# Altium schematic sheet hat.SchDoc: Micro controller test
size A3; DrawnBy: Mark Arunchayanon, Luke Trenberth, Abhimanyu Chhabara, Sasiru Goonatillake; Address1: ECE Department; Address2: University of Canterbury; Address3: Christchurch 8041; Address4: New Zealand; Revision: 1
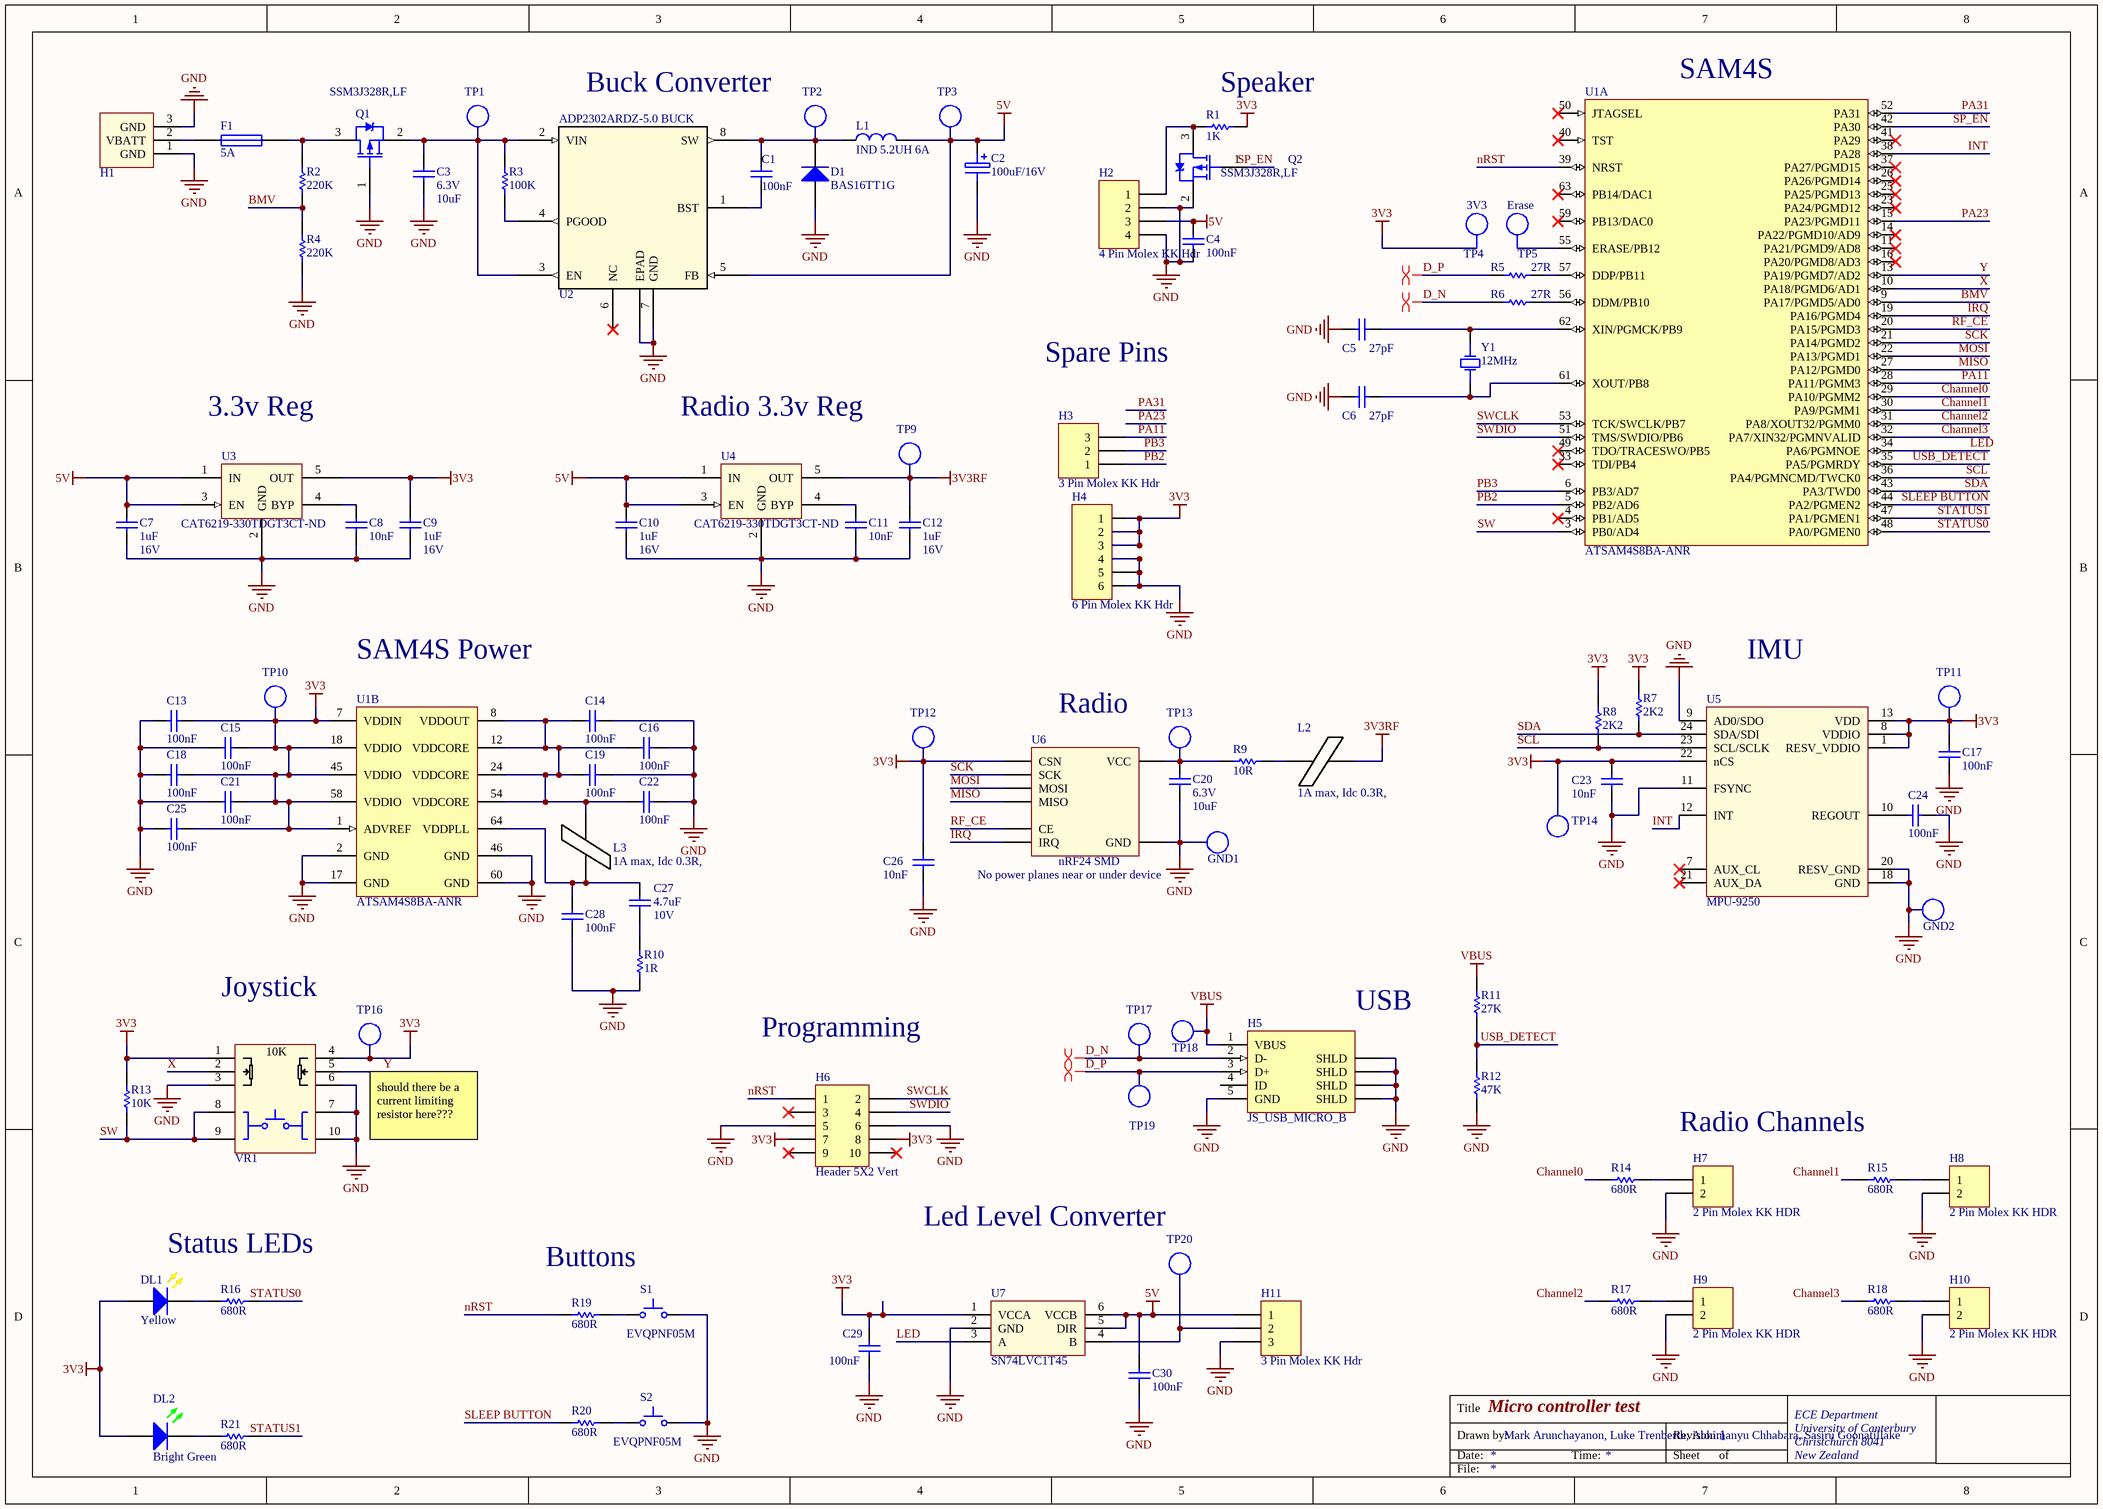
[diagram p0: hat.SchDoc]

## Parts
C1  100nF  [CAPC1608L]
C2  100uF/16V  [NICH-1]
C3  Voltage - Rated: 6.3V  [CAPC1608L]  (hidden comment: 10uF)
C4  100nF  [CAPC1608L]
C5  27pF  [CAPC1608L]
C6  27pF  [CAPC1608L]
C7  Max Voltage: 16V  [CAPC1608L]  (hidden comment: 1uF)
C8  10nF  [CAPC1608L]
C9  Max Voltage: 16V  [CAPC1608L]  (hidden comment: 1uF)
C10  Max Voltage: 16V  [CAPC1608L]  (hidden comment: 1uF)
C11  10nF  [CAPC1608L]
C12  Max Voltage: 16V  [CAPC1608L]  (hidden comment: 1uF)
C13  100nF  [CAPC1608L]
C14  100nF  [CAPC1608L]
C15  100nF  [CAPC1608L]
C16  100nF  [CAPC1608L]
C17  100nF  [CAPC1608L]
C18  100nF  [CAPC1608L]
C19  100nF  [CAPC1608L]
C20  Voltage - Rated: 6.3V  [CAPC1608L]  (hidden comment: 10uF)
C21  100nF  [CAPC1608L]
C22  100nF  [CAPC1608L]
C23  10nF  [CAPC1608L]
C24  100nF  [CAPC1608L]
C25  100nF  [CAPC1608L]
C26  10nF  [CAPC1608L]
C27  Max Voltage: 10V  [CAPC1608N]  (hidden comment: 4.7uF)
C28  100nF  [CAPC1608L]
C29  100nF  [CAPC1608L]
C30  100nF  [CAPC1608L]
D1  BAS16TT1G  [SOT416]
DL1  Yellow  [WL-SMCW0603]
DL2  Bright Green  [WL-SMCW0603]
F1  5A  [RESC3216N]
GND1  TP_0603  [TP_0603]  (value not drawn)
GND2  TP_0603  [TP_0603]  (value not drawn)
H1  Battery_HEADER_3pin  [BATT_HEADER_3POS]  (value not drawn)
H2  value 4 Pin Molex KK Hdr  [MOLEX_KK_4_HDR]  (hidden comment: SMD Vert 1.25mm)
H3  3 Pin Molex KK Hdr  [MOLEX_KK_3_HDR]
H4  value 6 Pin Molex KK Hdr  [MOLEX_KK_6_HDR]  (hidden comment: SMD Vert 1.25mm)
H5  JS_USB_MICRO_B  [FCI_USB_10118194-0001LF]
H6  Header 5X2 Vert  [IDC2.54-V10D]
H7  value 2 Pin Molex KK HDR  [MOLEX_KK_2_HDR]  (hidden comment: SMD Vert 1.25mm)
H8  value 2 Pin Molex KK HDR  [MOLEX_KK_2_HDR]  (hidden comment: SMD Vert 1.25mm)
H9  value 2 Pin Molex KK HDR  [MOLEX_KK_2_HDR]  (hidden comment: SMD Vert 1.25mm)
H10  value 2 Pin Molex KK HDR  [MOLEX_KK_2_HDR]  (hidden comment: SMD Vert 1.25mm)
H11  value 3 Pin Molex KK Hdr  [MOLEX_KK_3_HDR]  (hidden comment: SMD Vert 1.25mm)
L1  IND 5.2UH 6A  [INDUCTOR5u2]
L2  1A max, Idc 0.3R,  [INDC3216L]
L3  1A max, Idc 0.3R,  [INDC3216L]
Q1  SSM3J328R,LF  [SOT23_L]
Q2  SSM3J328R,LF  [SOT23_L]
R1  1K  [RESC1608L]
R2  220K  [RESC1608L]
R3  100K  [RESC1608L]
R4  220K  [RESC1608L]
R5  27R  [RESC3216L]
R6  27R  [RESC3216L]
R7  2K2  [RESC1608L]
R8  2K2  [RESC1608L]
R9  10R  [RESC1608L]
R10  1R  [RESC3216L]
R11  27K  [RESC1608L]
R12  47K  [RESC1608N]
R13  10K  [RESC1608L]
R14  680R  [RESC1608L]
R15  680R  [RESC1608L]
R16  680R  [RESC1608L]
R17  680R  [RESC1608L]
R18  680R  [RESC1608L]
R19  680R  [RESC1608L]
R20  680R  [RESC1608L]
R21  680R  [RESC1608L]
S1  EVQPNF05M  [EVQPNF05M]
S2  EVQPNF05M  [EVQPNF05M]
TP1  TP_0603  [TP_0603]  (value not drawn)
TP2  TP_0603  [TP_0603]  (value not drawn)
TP3  TP_0603  [TP_0603]  (value not drawn)
TP4  3V3  [TP_1206]  (no BOM)
TP5  Erase  [TP_1206]  (no BOM)
TP9  TP_0603  [TP_0603]  (value not drawn)
TP10  TP_0603  [TP_0603]  (value not drawn)
TP11  TP_0603  [TP_0603]  (value not drawn)
TP12  TP_0603  [TP_0603]  (value not drawn)
TP13  TP_0603  [TP_0603]  (value not drawn)
TP14  TP_0603  [TP_0603]  (value not drawn)
TP16  TP_0603  [TP_0603]  (value not drawn)
TP17  TP_0603  [TP_0603]  (value not drawn)
TP18  TP_0603  [TP_0603]  (value not drawn)
TP19  TP_0603  [TP_0603]  (value not drawn)
TP20  TP_0603  [TP_0603]  (value not drawn)
U1  ATSAM4S8BA-ANR  [LQFP64_L]  (parts A,B of 2)
U2  ADP2302ARDZ-5.0 BUCK  [RD_8_1]
U3  Supplier Part Number: CAT6219-330TDGT3CT-ND  [SOT95P280X145-5N]  (hidden comment: CAT6219-330TDGT3)
U4  Supplier Part Number: CAT6219-330TDGT3CT-ND  [SOT95P280X145-5N]  (hidden comment: CAT6219-330TDGT3)
U5  MPU-9250  [Quad24]
U6  nRF24 SMD  Warning: No power planes near or under device  [NRF24]
U7  SN74LVC1T45  [SOT23-6_N]
VR1  Joystick 10k with Sw  [Joystick_Sw]  (value not drawn)
Y1  12MHz  [6.0X3.5-4]

## Nets
3V3: C9.2 C13.1 C15.1 C17.2 C18.1 C21.1 C23.2 C25.1 C26.2 C29.1 DL1.2(A) DL2.2(A) H4.1 H4.2 H4.3 H6.7 H6.8 R1.2 R7.2 R8.2 R13.2 TP4.1 TP10.1(TP) TP11.1(TP) TP12.1(TP) TP14.1(TP) TP16.1(TP) U1.1(ADVREF) U1.7(VDDIN) U1.18(VDDIO) U1.45(VDDIO) U1.58(VDDIO) U3.5(OUT) U5.1(RESV_VDDIO) U5.8(VDDIO) U5.13(VDD) U5.22(nCS) U6.4(CSN) U7.1(VCCA) VR1.1 VR1.4(1')
3V3RF: C12.2 L2.2 TP9.1(TP) U4.5(OUT)
5V: C2.2 C4.2 C7.2 C10.2 C30.1 H2.3 H11.1 L1.2 TP3.1(TP) U2.5(FB) U3.1(IN) U3.3(EN) U4.1(IN) U4.3(EN) U7.5(DIR) U7.6(VCCB)
GND: C2.1 C3.1 C4.1 C5.1 C6.1 C7.1 C8.1 C9.1 C10.1 C11.1 C12.1 C13.2 C14.1 C15.2 C16.1 C17.1 C18.2 C19.1 C20.1 C21.2 C22.1 C23.1 C24.1 C25.2 C26.1 C28.2 C29.2 C30.2 D1.1(A) GND1.1(TP) GND2.1(TP) H1.1(GND) H1.3(GND) H2.2 H2.4 H4.4 H4.5 H4.6 H5.5(GND) H5.6(SHLD) H6.5 H6.6 H7.2 H8.2 H9.2 H10.2 H11.3 Q1.1 Q2.2 R4.1 R10.1 R12.1 S1.2 S2.2 U1.2(GND) U1.17(GND) U1.46(GND) U1.60(GND) U2.7(GND) U2.EPAD U3.2(GND) U4.2(GND) U5.9(AD0/SDO) U5.11(FSYNC) U5.18(GND) U5.20(RESV_GND) U6.2(GND) U7.2(GND) VR1.3 VR1.6(3') VR1.7 VR1.10
VBUS: H5.1(VBUS) R11.2 TP18.1(TP)
BMV: R2.1 R4.2 U1.9(PA17/PGMD5/AD0)
Channel0: R14.1 U1.29(PA10/PGMM2)
Channel1: R15.1 U1.30(PA9/PGMM1)
Channel2: R17.1 U1.31(PA8/XOUT32/PGMM0)
Channel3: R18.1 U1.32(PA7/XIN32/PGMNVALID)
D_N: H5.2(D-) R6.1 TP17.1(TP)
D_P: H5.3(D+) R5.1 TP19.1(TP)
INT: U1.38(PA28) U5.12(INT)
IRQ: U1.19(PA16/PGMD4) U6.8(IRQ)
LED: U1.34(PA6/PGMNOE) U7.3(A)
MISO: U1.27(PA12/PGMD0) U6.7(MISO)
MOSI: U1.22(PA13/PGMD1) U6.6(MOSI)
nRST: H6.1 R19.1 U1.39(NRST)
PA11: H3.3 U1.28(PA11/PGMM3)
PA23: U1.15(PA23/PGMD11)
PA31: U1.52(PA31)
PB2: H3.1 U1.5(PB2/AD6)
PB3: H3.2 U1.6(PB3/AD7)
RF_CE: U1.20(PA15/PGMD3) U6.3(CE)
SCK: U1.21(PA14/PGMD2) U6.5(SCK)
SCL: R8.1 U1.36(PA4/PGMNCMD/TWCK0) U5.23(SCL/SCLK)
SDA: R7.1 U1.43(PA3/TWD0) U5.24(SDA/SDI)
SLEEP BUTTON: R20.1 U1.44(PA2/PGMEN2)
SP_EN: Q2.1 U1.42(PA30)
STATUS0: R16.2 U1.48(PA0/PGMEN0)
STATUS1: R21.2 U1.47(PA1/PGMEN1)
SW: R13.1 U1.3(PB0/AD4) VR1.8 VR1.9
SWCLK: H6.2 U1.53(TCK/SWCLK/PB7)
SWDIO: H6.4 U1.51(TMS/SWDIO/PB6)
USB_DETECT: R11.1 R12.2 U1.35(PA5/PGMRDY)
X: U1.10(PA18/PGMD6/AD1) VR1.2
Y: U1.13(PA19/PGMD7/AD2) VR1.5(2')
NetC1_1: C1.1 D1.3(K) L1.1 TP2.1(TP) U2.8(SW)
NetC1_2: C1.2 U2.1(BST)
NetC3_2: C3.2 Q1.2 R3.2 TP1.1(TP) U2.2(VIN) U2.3(EN)
NetC5_2: C5.2 U1.62(XIN/PGMCK/PB9) Y1.3(OSC2)
NetC6_2: C6.2 U1.61(XOUT/PB8) Y1.1(OSC1)
NetC8_2: C8.2 U3.4(BYP)
NetC11_2: C11.2 U4.4(BYP)
NetC14_2: C14.2 C16.2 C19.2 C22.2 L3.2 U1.8(VDDOUT) U1.12(VDDCORE) U1.24(VDDCORE) U1.54(VDDCORE)
NetC20_2: C20.2 R9.1 TP13.1(TP) U6.1(VCC)
NetC24_2: C24.2 U5.10(REGOUT)
NetC27_1: C27.1 R10.2
NetC27_2: C27.2 C28.1 L3.1 U1.64(VDDPLL)
NetDL1_1: DL1.1(K) R16.1
NetDL2_1: DL2.1(K) R21.1
NetF1_1: F1.1 H1.2(VBATT)
NetF1_2: F1.2 Q1.3 R2.2
NetH2_1: H2.1 Q2.3 R1.1
NetH7_1: H7.1 R14.2
NetH8_1: H8.1 R15.2
NetH9_1: H9.1 R17.2
NetH10_1: H10.1 R18.2
NetH11_2: H11.2 TP20.1(TP) U7.4(B)
NetL2_1: L2.1 R9.2
NetR3_1: R3.1 U2.4(PGOOD)
NetR5_2: R5.2 U1.57(DDP/PB11)
NetR6_2: R6.2 U1.56(DDM/PB10)
NetR19_2: R19.2 S1.1
NetR20_2: R20.2 S2.1
NetTP5_1: TP5.1 U1.55(ERASE/PB12)

Not connected (* = marked no-connect by the designer): H5 4(ID); H6 3* 9* 10*; U1 4(PB1/AD5)* 11(PA21/PGMD9/AD8)* 14(PA22/PGMD10/AD9)* 16(PA20/PGMD8/AD3)* 23(PA24/PGMD12)* 25(PA25/PGMD13)* 26(PA26/PGMD14)* 33(TDI/PB4)* 37(PA27/PGMD15)* 40(TST)* 41(PA29)* 49(TDO/TRACESWO/PB5)* 50(JTAGSEL)* 59(PB13/DAC0)* 63(PB14/DAC1)*; U2 6(NC)*; U5 7(AUX_CL)* 21(AUX_DA)*

## Layout directives
differential pair: D_N, D_P

## Notes on the sheet
- Buck Converter
- (near R1) Speaker
- (near U1) SAM4S
- Spare Pins
- 3.3v Reg
- Radio 3.3v Reg
- SAM4S Power
- Radio
- IMU
- Joystick
- Programming
- (near H5) USB
- (near TP16) should there be a current limiting resistor here???
- Radio Channels
- Status LEDs
- (near TP20) Led Level Converter
- Buttons
- Title
- Drawn by:
- Date:
- Time:
- Revision:
- Sheet
- of
- File:
- (in symbol Joystick 10k with Sw) 10K

## Library data of the parts
C1 C4 C13-C19 C21 C22 C24 C25 C28-C30 = CC_100nF_0603: CAP CER 100nF X7R +-10% 50V 0603; PackageReference: 0603; Code_IPC: 1608 [0603]; Verify: *; Supplier: ECE Dept; Storage Location: PCB Assembly WS; Value: 100nF
C2 = CA_100uF_16V: CAP ALUM 100uF 16V SMD; Manufacturer PN: UWX1C101MCL1GB; Manufacturer: Nichcon; Supplier 1: Farnell; Supplier Part Number 1: 1870677; Storage Location: PCB Assembly WS; Supplier: ECE Dept; Supplier 2: Digi-Key; Supplier Part Number 2: 493-2105-1-ND; Value: 100uF/16V
C3 C20 = CC_10uF_0603: CAP CER 10UF X5R +-20% 6V3 0603; Supplier: ECE Dept; Storage Location: PCB Assembly WS; Value: 10uF
C5 C6 = CC_27pF_0603: CAP CER 27pF NPO/COG +-5% 50V 0603; PackageReference: 0603; Code_IPC: 1608 [0603]; Verify: *; Supplier: ECE Dept; Storage Location: PCB Assembly WS; Value: 27pF
C7 C9 C10 C12 = CC_1uF_0603: CAP CER 1uF Y5V -20% +80% 16V 0603; PackageReference: 0603; Code_IPC: 1608 [0603]; Verify: *; Supplier: ECE Dept; Storage Location: PCB Assembly WS; Value: 1uF
C8 C11 C23 C26 = CC_10nF_0603: CAP CER 10nF X7R +-10% 50V 0603; PackageReference: 0603; Code_IPC: 1608 [0603]; Verify: *; Supplier: ECE Dept; Storage Location: PCB Assembly WS; Value: 10nF
C27 = CC_4.7uF_0603: CAP CER 4.7uF X5R +-20%  10V 0603; Note: Footprint corresponds to dimensions for bulk cassette packaging. This case size has tightened tolerances.; PackageReference: 0805; Code_IPC: 2012[0805]; Verify: *; Supplier: ECE Dept; Storage Location: PCB Assembly WS; Value: 4.7uF
D1 = DR_BAS16TT1G: Diode Switching, Vr 75V, 200mA, SOT-416; Manufacturer: ON Semiconductor; Max Surge Current: 500mA; Forward Voltage: 1.25V; Peak Reverse Current: 1uA; Recovery Time: 6ns; Power Dissipation: 225mW; Element Configuration: Single; Polarity: Standard; Max Reverse Voltage (DC): 100V; Manufacturer PN: BAS16TT1G; Storage Location: PCB Assembly WS; Supplier: ECE Dept; Manufacturer Part Number: BAS16TT1G; Case/Package: SOT-416-3; Number of Pins: 3; Contact Plating: Tin,Matte; Min Operating Temperature: -55°C; Max Operating Temperature: 150°C; Package Quantity: 1; Packaging: Tape and Reel; Forward Current: 200mA; Average Rectified Current: 200mA; Reverse Recovery Time: 6ns; Peak Non-Repetitive Surge Current: 500mA; Max Repetitive Reverse Voltage (Vrrm): 75V; Max Forward Surge Current (Ifsm): 500mA; Current Rating: 200mA; Output Current: 200mA; Length: 1.65mm; Height: 0.9mm; Width: 0.9mm; Radiation Hardening: No; REACH SVHC: No SVHC; Lead Free: Lead Free; Halogen Free: Halogen Free; ComponentLink1URL: https://datasheet.ciiva.com/8299/bas16tt1-d-8299729.pdf; ComponentLink1Description: https://datasheet.ciiva.com/8299/bas16tt1-d-8299729.pdf; ComponentLink2URL: https://datasheet.ciiva.com/4435/bas16tt1-d-103455-4435027.pdf; ComponentLink2Description: https://datasheet.ciiva.com/4435/bas16tt1-d-103455-4435027.pdf; ComponentLink3URL: https://datasheet.ciiva.com/28646/bas16tt1-d-28646580.pdf; ComponentLink3Description: https://datasheet.ciiva.com/28646/bas16tt1-d-28646580.pdf; ComponentLink4URL: https://datasheet.ciiva.com/16393/bas16tt1-d-16393622.pdf; ComponentLink4Description: https://datasheet.ciiva.com/16393/bas16tt1-d-16393622.pdf; ComponentLink5URL: https://datasheet.ciiva.com/923/bas16tt1-d-923016.pdf; ComponentLink5Description: https://datasheet.ciiva.com/923/bas16tt1-d-923016.pdf; ComponentLink6URL: https://datasheet.ciiva.com/923/bas16tt1-d-923017.pdf; ComponentLink6Description: https://datasheet.ciiva.com/923/bas16tt1-d-923017.pdf; ComponentLink7URL: https://datasheet.ciiva.com/923/bas16tt1-d-923018.pdf; ComponentLink7Description: https://datasheet.ciiva.com/923/bas16tt1-d-923018.pdf; ComponentLink8URL: https://datasheet.ciiva.com/25930/bas16tt1-d-25930986.pdf; ComponentLink8Description: https://datasheet.ciiva.com/25930/bas16tt1-d-25930986.pdf; Supplier 1: Digi-Key; Supplier 2: Farnell; Supplier Part Number 2: 2844752; Supplier Part Number 1: BAS16TT1GOSDKR-ND; Value: BAS16TT1G
DL1 = DL_150060YS75000: LED Yellow 120mcd 0603 SMD; Manufacturer: WURTH ELEKTRONIK; Forward Current If: 30; Forward Voltage: 2; Wavelength Typ: 590; Lens Shape: Rectangular; Viewing Angle: 140°; Luminous Intensity: 120; LED Mounting: SMD; Supplier 1: Farnell; Supplier Part Number 1: 2322074; Manufacturer Part Number: 150060YS75000; Storage Location: PCB Assembly WS; Supplier: ECE Dept; LED Colour: Yellow
DL2 = DL_150060VS75000: LED Bright Green 40mcd 0603 SMD; Manufacturer: WURTH ELEKTRONIK; Forward Current If: 30; Forward Voltage: 2; Viewing Angle: 140°; Wavelength Typ: 570; Luminous Intensity: 40; LED Mounting: SMD; Supplier 1: Farnell; Supplier Part Number 1: 2322073; Manufacturer Part Number: 150060VS75000; Storage Location: PCB Assembly WS; Supplier: ECE Dept; LED Colour: Bright Green
F1 = FS_Fuse_5.0A: Fuse 5.0A Fast Acting 1206 SMD; Manufacturer Part Number: C1F5; Manufacturer: Bel TRP; Voltage Rating (AC): 125V; Voltage Rating (DC): 63V; DC Cold Resistance: 19mR; Fuse Type: Board Mount (Cartridge Style Excluded); Approvals: CE,cURus; Mount: Surface Mount; Case/Package: 1206; Number of Pins: 2; Case Code (Metric): 3216; Case Code (Imperial): 1206; Contact Plating: Nickel,Tin; Min Operating Temperature: -55°C; Max Operating Temperature: 125°C; Packaging: Tape and Reel; Voltage Rating: 125V; Length: 0.126inch; Width: 0.062inch; Supplier 1: Digi-Key; Stock 1: 725; Pricing 1: 1=0.32, 5=0.312, 10=0.298, 50=0.2662, 100=0.2479, 250=0.22032, 500=0.1836, 1000=0.17442 (USD); ComponentLink1URL: http://www.farnell.com/datasheets/2571625.pdf; ComponentLink1Description: http://www.farnell.com/datasheets/2571625.pdf; ComponentLink2URL: http://belfuse.com/pdfs/C1F.pdf; ComponentLink2Description: http://belfuse.com/pdfs/C1F.pdf; ComponentLink3URL: http://www.mouser.com/ds/2/643/C1F-594910.pdf; ComponentLink3Description: http://www.mouser.com/ds/2/643/C1F-594910.pdf; ComponentLink4URL: https://belfuse.com/resources/StewartConnector/C1F.pdf; ComponentLink4Description: https://belfuse.com/resources/StewartConnector/C1F.pdf; Current Rating: 5A; Supplier Part Number 1: 507-1886-1-ND; Supplier 2: Element14; Supplier Part Number 2: 2848595; Value: 5A
GND1 GND2 TP1-TP3 TP9-TP14 TP16-TP20 = TP_0603: Test Point 1.65X0.9X1.2mm SMD; Manufacturer: TE Connectivity AMP Connectors; Manufacturer Part Number: 1625854-3; Supplier 1: Digi-Key; Mounting Type: Surface Mount; Terminal: 0.063" x 0.031" x 0.045" (1.60mm x 0.80mm x 1.15mm); Type: PC Test Point; Supplier Part Number 1: A106145CT-ND
H1 = Battery_HEADER_3pin: 3Pin Header 2.54mm spacing
H2 = JA_MOLEX_KK_4POS: CONN HEADER 4POS 2.54mm VERT_Thru Hole; Manufacturer: Molex; Manufacturer PN: 22-23-2041; Supplier 1: Farnell; Supplier Part Number 1: 9731164; Supplier: ECE Dept; Storage Location: ECE Dept Store
H3 = JA_MOLEX_KK_3POS: CONN HEADER 3POS 2.54mm VERT_Thru Hole; Manufacturer: Molex; Manufacturer PN: 22-23-2031; Supplier 1: Farnell; Supplier Part Number 1: 9731156; Supplier: ECE Dept; Storage Location: ECE Dept Store; Value: 3 Pin Molex KK Hdr
H4 = JA_MOLEX_KK_6POS: CONN HEADER 6POS 2.54mm VERT_Thru Hole; Supplier 1: Farnell; Supplier Part Number 1: 1462922; Supplier: ECE Dept; Storage Location: ECE Dept Store
H5 = JS_USB_MICRO_B_SMT: CONN USB MICRO B RECPT SMT R/A; Manufacturer: FCI; Manufacturer Part Number: 10118194-0001LF; Gender: Receptacle; Number of Contacts: 5; Specifications: USB 2.0; Supplier 1: Digi-Key; Supplier Part Number 1: 609-4618-1-ND; Features: Shielded, Solder Retention; Mounting Type: Surface Mount, Right Angle, Horizontal
H6 = JA_HDR_IDC_5X2_VERT: IDC Header, 2,54mm, 10-Pin, Vert; Supplier: ECE Dept; Supplier 1: Farnell; Supplier Part Number 1: 1096985; Storage Location: ECE Dept Store
H7-H10 = JA_MOLEX_KK_2POS: CONN HEADER 2POS 2.54mm VERT_Thru Hole; Supplier 1: Farnell; Supplier Part Number 1: 1462926; Supplier: ECE Dept; Storage Location: ECE Dept Store
H11 = JA_MOLEX_KK_3POS: CONN HEADER 3POS 2.54mm VERT_Thru Hole; Manufacturer: Molex; Supplier 1: Farnell; Supplier Part Number 1: 9731156; Supplier: ECE Dept; Storage Location: ECE Dept Store; Manufacturer PN: 22-23-2031
L1 = CDRH104RNP-5R2NC: FIXED IND 5.2UH 6A 22 MOHM SMD; Manufacturer: Sumida America Components Inc.; Material - Core: Ferrite; Tolerance: ±30%; Current - Saturation: 5.6A; Shielding: Shielded; DC Resistance (DCR): 22 mOhm Max; Supplier 1: Digi-Key; Manufacturer Part Number: CDRH104RNP-5R2NC; RoHS: RoHS Compliant; Category: Inductors, Coils, Chokes; Stock 1: 3849; Pricing 1: 1=2.9, 10=2.678, 100=1.8743, 500=1.5173 (NZD); Packaging: Cut Tape (CT); Part Status: Active; Type: -; Q @ Freq: -; Frequency - Self Resonant: -; Ratings: -; Operating Temperature: -40°C ~ 100°C; Mounting Type: Surface Mount; Package / Case: Nonstandard; Supplier Device Package: -; Size / Dimension: 0.402" L x 0.394" W (10.20mm x 10.00mm); Height - Seated (Max): 0.157" (4.00mm); ComponentLink1URL: http://products.sumida.com/products/pdf/CDRH104R.pdf; ComponentLink1Description: http://products.sumida.com/products/pdf/CDRH104R.pdf; Supplier Part Number 1: 308-2280-1-ND
L2 L3 = IN_Ferrite-Bead: Ferrite Bead, Rdc 0.3R, Z100MHZ 600R, Imax 1A, SMD 1206; Manufacturer: FAIR-RITE; Manufacturer PN: 2512066017Y1; DC Current Rating: 1; DC Resistance Max: 0.08; Ferrite Case Style: 1206 ^3216 Metric]; Frequency Range: 50MHz to 1; Impedance: 600; Impedance Tolerance: ± 25%; Supplier: ECE Dept; Storage Location: PCB Assembly WS; Ferrite Mounting: SMD; Supplier 1: Farnell; Supplier Part Number 1: 1612060; Manufacturer Part Number: 2512066017Y1; Value: 1A max, Idc 0.3R,
Q1 Q2 = TM_SSM3J328R: MOSFET P-CH 20V 6A SOT23-3; Manufacturer: Toshiba; FET Feature: Logic Level Gate, 1.5V Drive; FET Type: MOSFET P-Channel, Metal Oxide; Gate Charge (Qg) @ Vgs: 12.8nC @ 4.5V; Input Capacitance (Ciss) @ Vds: 840pF @ 10V; Power - Max: 1W; Rds On Max: 29.8mR; Drain to Source Resistance: 47.4mR; Turn-On Delay Time: 32ns; Power Dissipation: 2W; Number of Channels: 1; Turn-Off Delay Time: 107ns; Gate to Source Voltage (Vgs): 8V; Input Capacitance: 840pF; Element Configuration: Single; Drain to Source Breakdown Voltage: -20V; Vgs(th) (Max) @ Id: 1V @ 1mA; Current - Continuous Drain (Id) @ 25° C: 6A; Drain to Source Voltage (Vdss): 20V; Package / Case: SOT-23-3 Flat Leads; Supplier Device Package: SOT-23F; Pricing: 1=0.79, 10=0.658, 25=0.5772, 100=0.4939, 250=0.42836, 500=0.36284, 1000=0.27972 (NZD); Storage Location: PCB Assembly WS; Supplier: Digi-Key; ComponentLink1URL: https://datasheet.ciiva.com/11158/ssm3j328r-datasheet-en-20140301-11158652.pdf; ComponentLink1Description: https://datasheet.ciiva.com/11158/ssm3j328r-datasheet-en-20140301-11158652.pdf; Supplier Part Number: SSM3J328RLFDKR-ND; Max Operating Temperature: 150°C; Mount: Surface Mount; Packaging: Tape and Reel; Min Operating Temperature: -55°C; Continuous Drain Current (ID): 6A; Radiation Hardening: No; Max Power Dissipation: 1W; Package Quantity: 3000; Case/Package: SOT-23-3; Number of Pins: 3; Number of Elements: 1; Supplier 1: Digi-Key; Supplier Part Number 1: SSM3J328RLFDKR-ND; Manufacturer Part Number: SSM3J328R,LF
R1 = RS_1K: RES 1.0K OHM 1/10W 5% 0603 SMD; Storage Location: PCB Assembly WS; Supplier: ECE Dept; Value: 1K
R2 R4 = RS_220K: RES 3.3K OHM 1/10W 5% 0603 SMD; Storage Location: PCB Assembly WS; Supplier: ECE Dept; Value: 220K
R3 = RS_100K: RES 100K OHM 1/10W 5% 0603 SMD; Storage Location: PCB Assembly WS; Supplier: ECE Dept; Value: 100K
R5 R6 = RT_27R: RES 27R OHM 1/4W 5% 1206 SMD; Storage Location: PCB Assembly WS; Supplier: ECE Dept; Value: 27R
R7 R8 = RS_2K2: RES 2.2K OHM 1/10W 5% 0603 SMD; Storage Location: PCB Assembly WS; Supplier: ECE Dept; Value: 2K2
R9 = RS_10R: RES 10 OHM 1/10W 5% 0603 SMD; Storage Location: PCB Assembly WS; Supplier: ECE Dept; Value: 10R
R10 = RT_1R: RES 1R OHM 1/4W 5% 1206 SMD; Storage Location: PCB Assembly WS; Supplier: ECE Dept; Value: 1R
R11 = RS_27K: RES 27K OHM 1/10W 5% 0603 SMD; Storage Location: PCB Assembly WS; Supplier: ECE Dept; Value: 27K
R12 = RS_47K: RES 47.0K OHM 1/10W 5% 0603 SMD; Storage Location: PCB Assembly WS; Supplier: ECE Dept; Value: 47K
R13 = RS_10K: RES 10.0K OHM 1/10W 5% 0603 SMD; Storage Location: PCB Assembly WS; Supplier: ECE Dept; Value: 10K
R14-R21 = RS_680R: RES 680 OHM 1/10W 5% 0603 SMD; Storage Location: PCB Assembly WS; Supplier: ECE Dept; Value: 680R
S1 S2 = WS_EVQPNF05M: Panasonic 6 x 3.5mm SMD Light Touch Switch Type SMD; PackageDescription: 6.0 x 3.5 mm; Supplier 1: Farnell; Supplier Part Number 1: 2079481; Manufacturer: Panasonic; Manufacturer PN: EVQPNF05M; Supplier 2: Digi-Key; Supplier Part Number 2: P13598SCT-ND; Storage Location: PCB Assembly WS; Supplier: ECE Dept
TP4 TP5 = TP_1206: Test-Point 3.3x1.6x2.1mm SMD; Manufacturer: Harwin Inc; Manufacturer Part Number: S1751-46R; Value: TP; Manufacturer PN: *; Storage Location: ProtoPlace; Mounting Type: Surface Mount; Type: PC Test Point; Supplier 1: Digi-Key; Supplier Part Number 1: 952-1478-2-ND; Supplier 2: Farnell; Supplier Part Number 2: 1826282; Supplier: ECE Dept
U1 = SE_ATSAM4S16BA-MU: IC MCU 32BIT 512KB FLASH 64LQFP; Manufacturer: Atmel; Connectivity: I²C, IrDA, Memory Card, SPI, SSC, UART/USART, USB; Core Processor: ARM® Cortex®-M4; Core Size: 32-Bit; Data Converters: A/D 11x12b, D/A 2x12b; Number of I/O: 47; Peripherals: Brown-out Detect/Reset, DMA, POR, PWM, WDT; Program Memory Size: 512KB (512K x 8); RAM Size: 128K x 8; Speed: 120MHz; Voltage - Supply (Vcc/Vdd): 1.62 V ~ 3.6 V; PackageVersion: revJ, Jul-2007; PackageReference: 64PS; PackageDescription: 64-Pin Quad Flat No-Lead (QFN) Sawn, 9 x 9 x 1.0 mm Body, 0.5 mm Pitch, Exposed Pad; Code_JEDEC: MO-220VMMD-3; ComponentLink1Description: Manufacturer URL; ComponentLink1URL: http://www.atmel.com/; ComponentLink2Description: SAM4S Series Datasheet; ComponentLink2URL: http://www.atmel.com/dyn/resources/prod_documents/11100.pdf; ComponentLink3Description: SAM4S Series Summary; ComponentLink3URL: http://www.atmel.com/dyn/resources/prod_documents/11100S.pdf; Supplier 1: Digi-Key; Package / Case: 64-LQFP; Packaging: Cut Tape (CT); Program Memory Type: FLASH; Supplier Part Number 1: ATSAM4S8BA-ANRCT-ND; Manufacturer Part Number: ATSAM4S8BA-ANR
U2 = ADP2302ARDZ-5.0-R7: IC REG BUCK 5V 2A 8SOIC; Vendor: Analog Devices Inc; Frequency - Switching: 700kHz; Output Type: Fixed; Voltage - Input (Max): 20V; Manufacturer_Part_Number: ADP2302ARDZ-5.0-R7; Type: DEV; Value: Value; Supplier 1: Digi-Key; Current - Output: 2A; Voltage - Output (Min/Fixed): 5V; Supplier Part Number 1: ADP2302ARDZ-5.0-R7CT-ND
U3 U4 = SV_CAT6219-330TDGT3: IC REG LIN 3.3V 500MA TSOT23-5; Voltage - Input (Max): 5.5V; Voltage Dropout (Max): 0.5V @ 500mA; Manufacturer Part Number: CAT6219-330TDGT3; Base Part Number: CAT6219; Current - Output: 500mA; Package / Case: SOT-23-5 Thin, TSOT-23-5; Supplier: Digi-Key; Supplier Device Package: TSOT-23-5; Voltage - Output (Min/Fixed): 3.3V; ComponentLink1URL: http://www.onsemi.com/pub/Collateral/CAT6219-D.PDF; ComponentLink1Description: http://www.onsemi.com/pub/Collateral/CAT6219-D.PDF; Supplier 1: Digi-Key
U5 = MPU-9250: 9 axis IMU
U6 = NRF24: nRF24 SMD Module
U7 = SN74LVC1T45: 1.8V - 5V level converter
VR1 = Joystick 10k with Sw: JOYSTICK 10K OHM 2 AXIS TH; Manufacturer 1: SparkFun; Manufacturer Part Number 1: COM-09032; Supplier 1: Digi-Key; Stock 1: 563; Pricing 1: 1=3.95000 (USD); RoHS: No; ComponentLink1URL: https://media.digikey.com/pdf/Data%20Sheets/Sparkfun%20PDFs/COM-09032_Web.pdf?src-supplier=Digi-Key; ComponentLink1Description: https://media.digikey.com/pdf/Data%20Sheets/Sparkfun%20PDFs/COM-09032_Web.pdf?src-supplier=Digi-Key; Supplier Part Number 1: 1568-1526-ND
Y1 = XT_CRYSTAL_12MHz_18pF: CRYSTAL 12MHZ 18PF 6X3.5mm SMD; Manufacturer: CTS-Frequency Controls; Manufacturer Part Number: 406C35D12M00000; ESR (Equivalent Series Resistance): 60 Ohm; Frequency Stability: ±50ppm; Frequency Tolerance: ±30ppm; Operating Mode: Fundamental; Supplier 1: Digi-Key; Supplier Part Number 1: CTX855CT-ND; Height: 0.047" (1.20mm); Load Capacitance: 18pF; Mounting Type: Surface Mount; Operating Temperature: -20°C ~ 70°C; Package / Case: 4-SMD, No Lead (DFN, LCC); Size / Dimension: 0.236" L x 0.138" W (6.00mm x 3.50mm); Frequency: 12MHz